# EAGLE schematic ogx360 (EAGLE 9.6.2)
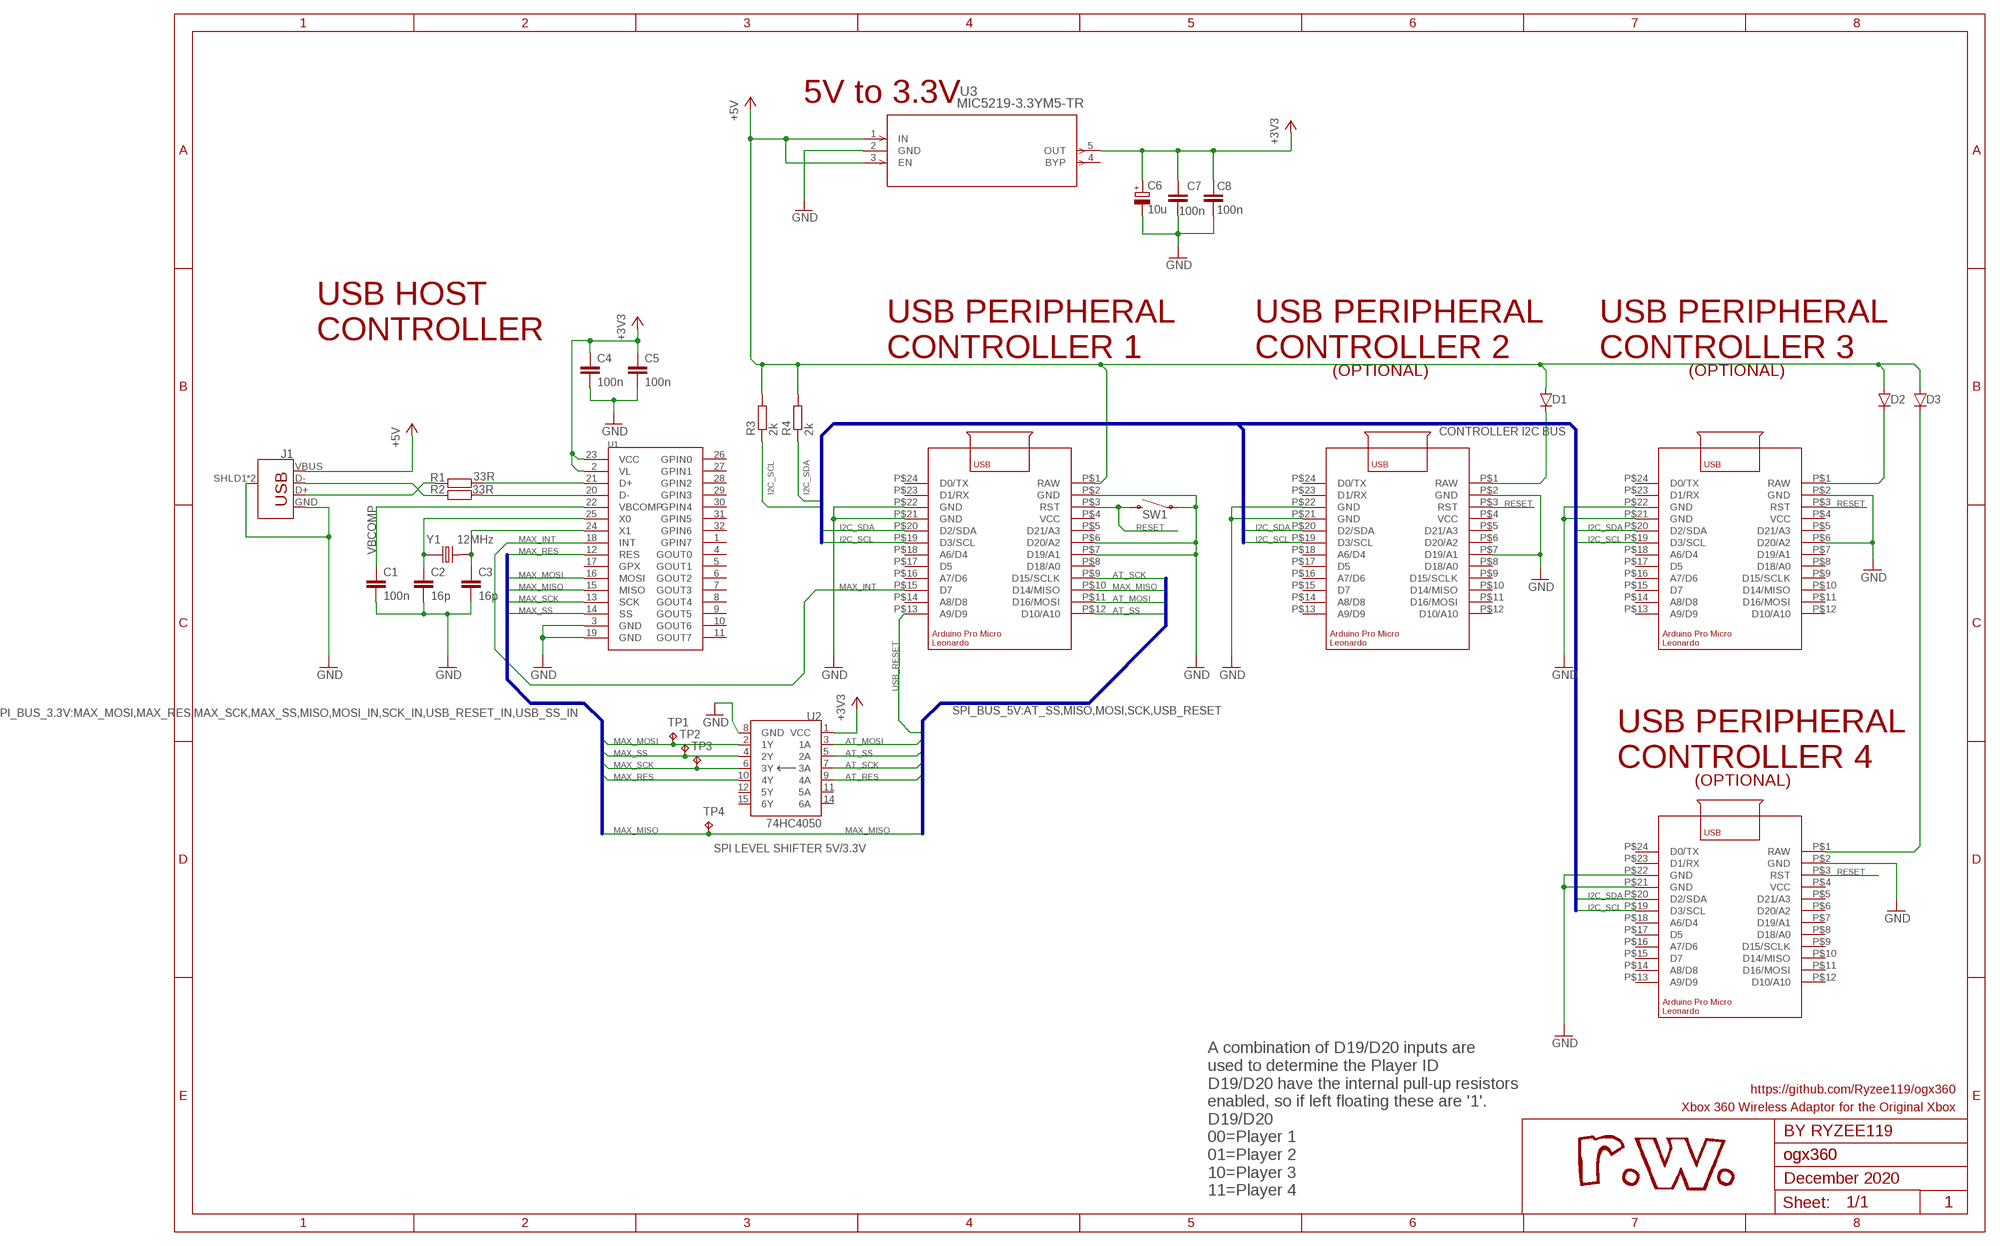
[diagram p0: schematic, sheet 1]

## Parts
C1  100n  C-EUC0805  [C0805]
C2  16p  C-EUC0805  [C0805]
C3  16p  C-EUC0805  [C0805]
C4  100n  C-EUC0805  [C0805]
C5  100n  C-EUC0805  [C0805]
C6  10u  CPOL-EU153CLV-0405  [153CLV-0405]
C7  100n  C-EUC0805  [C0805]
C8  100n  C-EUC0805  [C0805]
D1  DIODE-SOD123  [SOD123]
D2  DIODE-SOD123  [SOD123]
D3  DIODE-SOD123  [SOD123]
J1  USB_A_SMT_FEMALE_NS  [USB-A-S-NOSILK-FEMALE]
R1  33R  R-EU_R0805  [R0805]
R2  33R  R-EU_R0805  [R0805]
R3  2k  R-EU_R0805  [R0805]
R4  2k  R-EU_R0805  [R0805]
SW1  TL3305AF160QG  [TL3305AF160QG]
TP1  TPTP10R  [TP10R]
TP2  TPTP10R  [TP10R]
TP3  TPTP10R  [TP10R]
TP4  TPTP10R  [TP10R]
U1  MAX3421ETQFP32-5MM  [TQFP32-5X5MM]
U2  74HC4050  HEX_CONVERTER  [SO16]
U3  MIC5219-3.3YM5-TR  [SOT-23-5_M5_MCH]
U4  ARDUINO_LEONARDO_MICRO  [ARDUINO_LEONARDO_MICRO]
U5  ARDUINO_LEONARDO_MICRO  [ARDUINO_LEONARDO_MICRO]
U6  ARDUINO_LEONARDO_MICRO  [ARDUINO_LEONARDO_MICRO]
U7  ARDUINO_LEONARDO_MICRO  [ARDUINO_LEONARDO_MICRO]
Y1  12MHz  ECS-250-18-5PX-JEM-TR  [XTAL_ECS-250-18-5PX-JEM-TR]

## Nets
+3V3: C4.1 C5.1 C6.+ C7.1 C8.1 U1.2(VL) U1.23(VCC) U2.1(VCC) U3.5(OUT)
+5V: D1.A D2.A D3.A J1.VBUS R3.2 R4.2 U3.1(IN) U3.3(EN) U4.P$1(RAW)
+5V_SLAVE1: D1.C U5.P$1(RAW)
+5V_SLAVE2: D2.C U6.P$1(RAW)
+5V_SLAVE3: D3.C U7.P$1(RAW)
AT_MOSI: U2.3(1A) U4.P$11(D16/MOSI)
AT_RES: U2.9(4A)
AT_SCK: U2.7(3A) U4.P$9(D15/SCLK)
AT_SS: U2.5(2A) U4.P$12(D10/A10)
D_N: R2.1 U1.20(D-)
D_P: R1.1 U1.21(D+)
GND: C1.2 C2.2 C3.2 C4.2 C5.2 C6.- C7.2 C8.2 J1.GND J1.SHLD1(SHIELD) J1.SHLD2(SHIELD) SW1.P$3 SW1.P$4 U1.3(GND) U1.19(GND) U2.8(GND) U3.2(GND) U4.P$2(GND) U4.P$6(D20/A2) U4.P$7(D19/A1) U4.P$21(GND) U4.P$22(GND) U5.P$2(GND) U5.P$7(D19/A1) U5.P$21(GND) U5.P$22(GND) U6.P$2(GND) U6.P$6(D20/A2) U6.P$21(GND) U6.P$22(GND) U7.P$2(GND) U7.P$21(GND) U7.P$22(GND)
I2C_SCL: R3.1 U4.P$19(D3/SCL) U5.P$19(D3/SCL) U6.P$19(D3/SCL) U7.P$19(D3/SCL)
I2C_SDA: R4.1 U4.P$20(D2/SDA) U5.P$20(D2/SDA) U6.P$20(D2/SDA) U7.P$20(D2/SDA)
MAX_INT: U1.18(INT) U4.P$15(D7)
MAX_MISO: TP4.TP U1.15(MISO) U4.P$10(D14/MISO)
MAX_MOSI: TP1.TP U1.16(MOSI) U2.2(1Y)
MAX_RES: U1.12(RES) U2.10(4Y)
MAX_SCK: TP3.TP U1.13(SCK) U2.6(3Y)
MAX_SS: TP2.TP U1.14(SS) U2.4(2Y)
N$5: J1.D+ R1.2
N$8: J1.D- R2.2
N$9: C2.1 U1.25(X0) Y1.1
N$10: C3.1 U1.24(X1) Y1.2
RESET: SW1.P$1 SW1.P$2 U4.P$3(RST) U5.P$3(RST) U6.P$3(RST) U7.P$3(RST)
USB_RESET: U4.P$13(A9/D9)
VBCOMP: C1.1 U1.22(VBCOMP)
Unconnected: U1.1(GPIN7) U1.4(GOUT0) U1.5(GOUT1) U1.6(GOUT2) U1.7(GOUT3) U1.8(GOUT4) U1.9(GOUT5) U1.10(GOUT6) U1.11(GOUT7) U1.17(GPX) U1.26(GPIN0) U1.27(GPIN1) U1.28(GPIN2) U1.29(GPIN3) U1.30(GPIN4) U1.31(GPIN5) U1.32(GPIN6) U2.11(5A) U2.12(5Y) U2.14(6A) U2.15(6Y) U3.4(BYP) U4.P$4(VCC) U4.P$5(D21/A3) U4.P$8(D18/A0) U4.P$14(A8/D8) U4.P$16(A7/D6) U4.P$17(D5) U4.P$18(A6/D4) U4.P$23(D1/RX) U4.P$24(D0/TX) U5.P$4(VCC) U5.P$5(D21/A3) U5.P$6(D20/A2) U5.P$8(D18/A0) U5.P$9(D15/SCLK) U5.P$10(D14/MISO) U5.P$11(D16/MOSI) U5.P$12(D10/A10) U5.P$13(A9/D9) U5.P$14(A8/D8) U5.P$15(D7) U5.P$16(A7/D6) U5.P$17(D5) U5.P$18(A6/D4) U5.P$23(D1/RX) U5.P$24(D0/TX) U6.P$4(VCC) U6.P$5(D21/A3) U6.P$7(D19/A1) U6.P$8(D18/A0) U6.P$9(D15/SCLK) U6.P$10(D14/MISO) U6.P$11(D16/MOSI) U6.P$12(D10/A10) U6.P$13(A9/D9) U6.P$14(A8/D8) U6.P$15(D7) U6.P$16(A7/D6) U6.P$17(D5) U6.P$18(A6/D4) U6.P$23(D1/RX) U6.P$24(D0/TX) U7.P$4(VCC) U7.P$5(D21/A3) U7.P$6(D20/A2) U7.P$7(D19/A1) U7.P$8(D18/A0) U7.P$9(D15/SCLK) U7.P$10(D14/MISO) U7.P$11(D16/MOSI) U7.P$12(D10/A10) U7.P$13(A9/D9) U7.P$14(A8/D8) U7.P$15(D7) U7.P$16(A7/D6) U7.P$17(D5) U7.P$18(A6/D4) U7.P$23(D1/RX) U7.P$24(D0/TX)

## Buses
SPI_BUS_5V:AT_SS,MISO,MOSI,SCK,USB_RESET
SPI_BUS_3.3V:MAX_MOSI,MAX_RES,MAX_SCK,MAX_SS,MISO,MOSI_IN,SCK_IN,USB_RESET_IN,USB_SS_IN
I2C_SCL,I2C_SDA

## Notes on the sheet
- 5V to 3.3V
- USB HOST
  CONTROLLER
- USB PERIPHERAL
  CONTROLLER 1
- USB PERIPHERAL
  CONTROLLER 2
- USB PERIPHERAL
  CONTROLLER 3
- (OPTIONAL) | (OPTIONAL)
- CONTROLLER I2C BUS
- USB PERIPHERAL
  CONTROLLER 4
- (OPTIONAL)
- SPI LEVEL SHIFTER 5V/3.3V
- https://github.com/Ryzee119/ogx360
- Xbox 360 Wireless Adaptor for the Original Xbox
- BY RYZEE119
- ogx360
- December 2020
- A combination of D19/D20 inputs are
  used to determine the Player ID
  D19/D20 have the internal pull-up resistors
  enabled, so if left floating these are '1'.
  D19/D20
  00=Player 1
  01=Player 2
  10=Player 3
  11=Player 4
- 1

## Library data of the parts
C1-C5 C7 C8 = rcl:C-EU: CAPACITOR, European symbol; SPICEPREFIX: C
C6 = rcl:CPOL-EU: POLARIZED CAPACITOR, European symbol; SPICEPREFIX: C
D1-D3 = diode:DIODE-: DIODE
J1 = SparkFun-Connectors:USB_A: USB-A Connector Male and female variants, as well as PTH and SMT variants SparkFun Products: SparkFun XBee Explorer Dongle <https://www.sparkfun.com/products/11697> PTH Male SparkFun MicroView-USB Programmer <https://www.sparkfun.com/products/12924> SMT Male SparkFun USB Type A Female Breakout <https://www.sparkfun.com/products/12700> SMT Female; PROD_ID: CONN-09520; SF_ID: PRT-09011
R1-R4 = rcl:R-EU_: RESISTOR, European symbol; SPICEPREFIX: R
SW1 = my-library:TL3305AF160QG
TP1-TP4 = testpad:TP: Test pad
U1 = my-library:MAX3421E: USB Peripheral/Host Controller w/ SPI
U2 = SparkFun-IC-Comms:HEX_CONVERTER: 74HC4050 Hex Buffer 74HC4050 Hex Buffer Level Shifter SMD SO016 SparkFun Products CAN-BUS Shield <https://www.sparkfun.com/products/13262> (DEV-13262) SparkFun MP3 Player Shield <https://www.sparkfun.com/products/12660> (DEV-12660) SparkFun microSD Shield <https://www.sparkfun.com/products/12761> (DEV-12761) SparkFun USB Host Shield <https://www.sparkfun.com/products/9947> (DEV-09947); PROD_ID: IC-09604
U3 = my-library:MIC5219-3.3YM5-TR; BUILT_BY: EMA_Jessica; COPYRIGHT: Copyright (C) 2018 Accelerated Designs. All rights reserved; MANUFACTURER_PART_NUMBER: MIC5219-3.3YM5-TR; SOURCELIBRARY: Microchip_2019-08-23_3; VENDOR: Microchip
U4-U7 = my-library:ARDUINO_LEONARDO_MICRO
Y1 = ECS-250-18-5PX-JEM-TR:ECS-250-18-5PX-JEM-TR: CRYSTAL SMD; DESCRIPTION: 25MHz ±20ppm Crystal 18pF 30 Ohms HC-49/US; DIGI-KEY_PART_NUMBER: XC2083CT-ND; MF: ECS Inc.; MP: ECS-250-18-5PX-JEM-TR; PACKAGE: HC49/US ECS International; PURCHASE-URL: https://pricing.snapeda.com/search/part/ECS-250-18-5PX-JEM-TR/?ref=eda